# EAGLE design guitar balanced driver x2 (EAGLE 6.4)
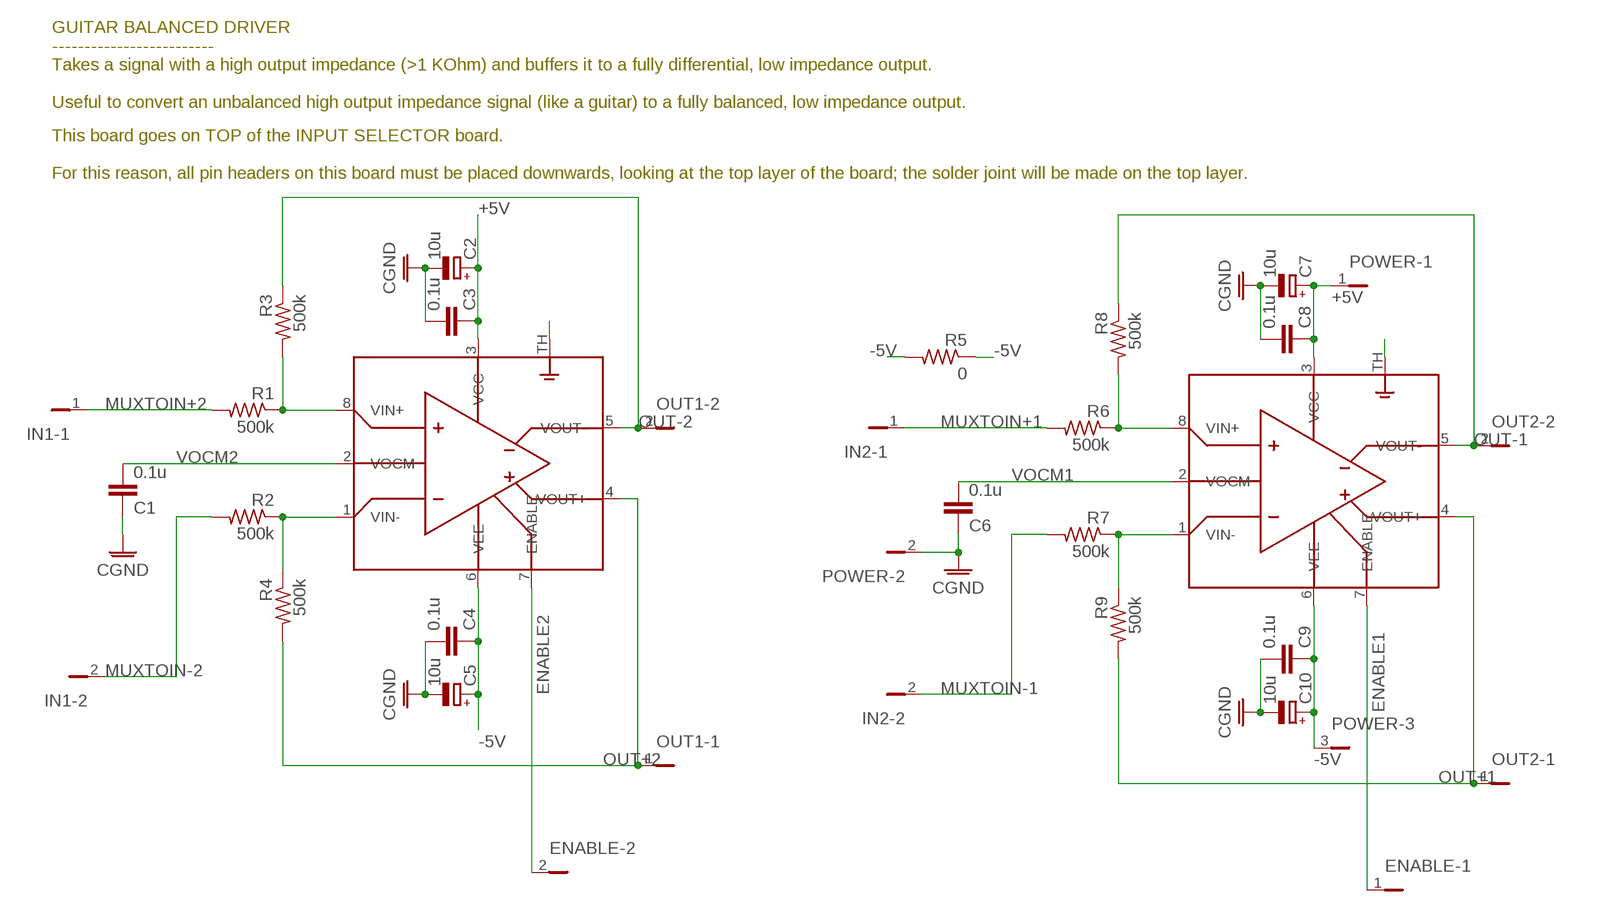
[diagram p0: schematic, sheet 1]

## Parts
C1  0.1u  C-EUC0603  [C0603]
C2  10u  CPOL-EUA  [PANASONIC_A]
C3  0.1u  C-EUC0603  [C0603]
C4  0.1u  C-EUC0603  [C0603]
C5  10u  CPOL-EUA  [PANASONIC_A]
C6  0.1u  C-EUC0603  [C0603]
C7  10u  CPOL-EUA  [PANASONIC_A]
C8  0.1u  C-EUC0603  [C0603]
C9  0.1u  C-EUC0603  [C0603]
C10  10u  CPOL-EUA  [PANASONIC_A]
ENABLE  PINHD-1X2  [1X02]
IN1  PINHD-1X2  [1X02]
IN2  PINHD-1X2  [1X02]
OA1  LME49724  [S-PDSO-G08]
OA2  LME49724  [S-PDSO-G08]
OUT1  PINHD-1X2  [1X02]
OUT2  PINHD-1X2  [1X02]
POWER  PINHD-1X3  [1X03]
R1  500k  R-US_R0603  [R0603]
R2  500k  R-US_R0603  [R0603]
R3  500k  R-US_R0603  [R0603]
R4  500k  R-US_R0603  [R0603]
R5  0  R-US_R0603  [R0603]
R6  500k  R-US_R0603  [R0603]
R7  500k  R-US_R0603  [R0603]
R8  500k  R-US_R0603  [R0603]
R9  500k  R-US_R0603  [R0603]

## Nets
+5V: C2.+ C3.1 C7.+ C8.1 OA1.3(VCC) OA2.3(VCC) POWER.1
-5V: C4.1 C5.+ C9.1 C10.+ OA1.6(VEE) OA1.TH(POWERPAD) OA2.6(VEE) OA2.TH(POWERPAD) POWER.3 R5.1 R5.2
CGND: C1.1 C2.- C3.2 C4.2 C5.- C6.1 C7.- C8.2 C9.2 C10.- POWER.2
ENABLE1: ENABLE.1 OA2.7(ENABLE)
ENABLE2: ENABLE.2 OA1.7(ENABLE)
MUXTOIN+1: IN2.1 R6.2
MUXTOIN+2: IN1.1 R1.2
MUXTOIN-1: IN2.2 R7.2
MUXTOIN-2: IN1.2 R2.2
OUT+1: OA2.4(VOUT+) OUT2.1 R9.2
OUT+2: OA1.4(VOUT+) OUT1.1 R4.2
OUT-1: OA2.5(VOUT-) OUT2.2 R8.1
OUT-2: OA1.5(VOUT-) OUT1.2 R3.1
VIN+1: OA2.8(VIN+) R6.1 R8.2
VIN+2: OA1.8(VIN+) R1.1 R3.2
VIN-1: OA2.1(VIN-) R7.1 R9.1
VIN-2: OA1.1(VIN-) R2.1 R4.1
VOCM1: C6.2 OA2.2(VOCM)
VOCM2: C1.2 OA1.2(VOCM)

## Notes on the sheet
- GUITAR BALANCED DRIVER
  -------------------------
  Takes a signal with a high output impedance (>1 KOhm) and buffers it to a fully differential, low impedance output.
  
  Useful to convert an unbalanced high output impedance signal (like a guitar) to a fully balanced, low impedance output.
- This board goes on TOP of the INPUT SELECTOR board.
  
  For this reason, all pin headers on this board must be placed downwards, looking at the top layer of the board; the solder joint will be made on the top layer.

## Library data of the parts
C1 C3 C4 C6 C8 C9 = rcl:C-EU: CAPACITOR, European symbol
C2 C5 C7 C10 = rcl:CPOL-EU: POLARIZED CAPACITOR, European symbol
ENABLE IN1 IN2 OUT1 OUT2 = pinhead:PINHD-1X2: PIN HEADER
OA1 OA2 = texas:LME49724
POWER = pinhead:PINHD-1X3: PIN HEADER
R1-R9 = resistor:R-US_: RESISTOR, American symbol

## Board
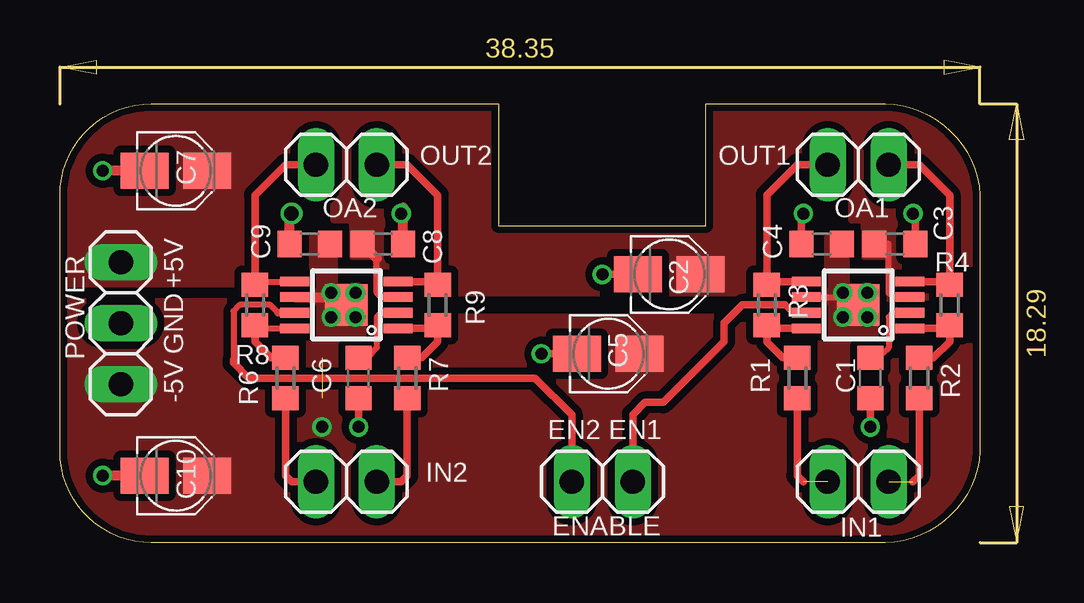
[diagram p1: board, top side]
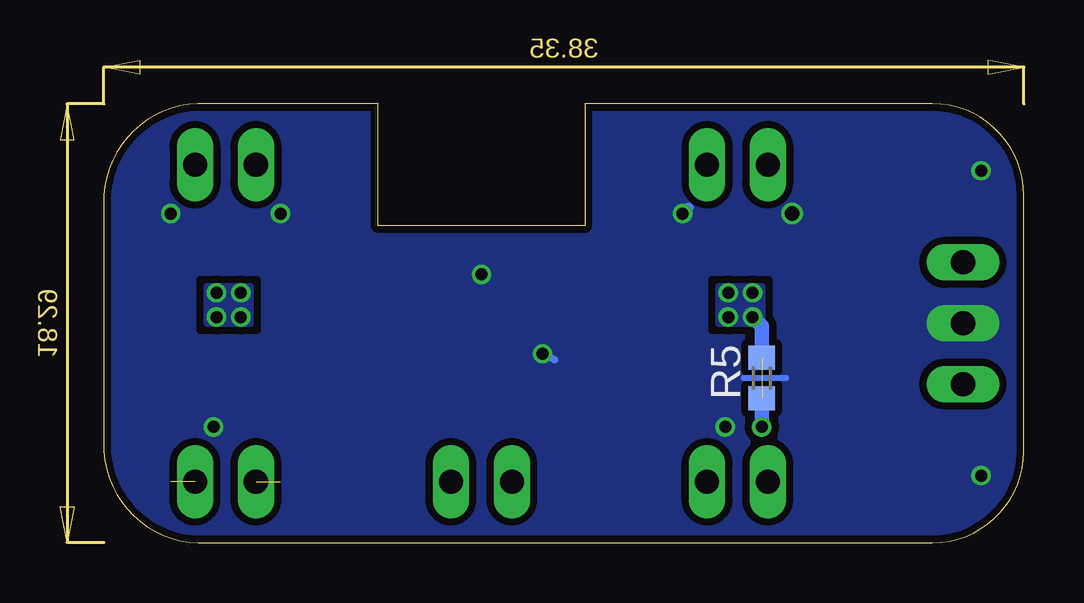
[diagram p2: board, bottom side, seen from below]

Size 38.35 x 18.3 mm. Coordinates in mm from the lower left corner, seen from the top.
Outline: 38.35,14.48 38.35,3.82 arc-90 34.04,0.01 3.81,0.01 arc-90 0,3.82 0,14.48 arc-90 3.81,18.29 18.29,18.29 18.29,13.21 26.92,13.21 26.92,18.29 34.04,18.29 arc-90 38.35,14.48
Copper layers (1*16): Top 0.035mm / dielectric 1.5mm / Bottom 0.035mm
Design rules "Fusion_eagle_rule_v1.1": minimum track width 6mil, minimum drill 12mil, track to track 6mil, track to pad 6mil, pad to pad 6mil, via to via 6mil, smd to smd 0mil, copper to edge 10mil, drill to drill 10mil, minimum pad ring 10mil, minimum via ring 6mil, stop-mask expansion 2mil, vias tented up to drill 100mil, thermal gap 10mil

### Footprints (pad centres in the part's own frame; a part is rotated, then mirrored left to right if it is on the bottom)
C0603 = smd 1 x 1.1: 1 -0.85,0; 2 0.85,0
PANASONIC_A = smd 2 x 1.5: + 1.3,0; - -1.3,0
1X02 = drill 1.016 long: 1 -1.27,0; 2 1.27,0
S-PDSO-G08 = smd 0.4 x 1.2: 1 -0.975,-2.157; 2 -0.325,-2.157; 3 0.325,-2.157; 4 0.975,-2.157; 5 0.975,2.157; 6 0.325,2.157; 7 -0.325,2.157; 8 -0.975,2.157 | smd 1.73 x 1.78: TH 0,0
1X03 = drill 1.016 long: 1 -2.54,0; 2 0,0; 3 2.54,0
R0603 = smd 1 x 1.1: 1 -0.85,0; 2 0.85,0

### Placement (x,y rotation side)
C1  33.78,6.86 90 top
C2  25.4,11.18 0 top
C3  34.8,12.45 0 top
C4  31.75,12.45 180 top
C5  22.86,7.88 0 top
C6  12.45,6.86 90 top
C7  4.83,15.5 0 top
C8  13.46,12.45 0 top
C9  10.41,12.45 180 top
C10  4.83,2.8 0 top
ENABLE  22.61,2.55 0 top
IN1  33.27,2.55 0 top
IN2  11.94,2.55 0 top
OA1  33.27,9.91 90 top
OA2  11.94,9.91 90 top
OUT1  33.27,15.75 180 top
OUT2  11.94,15.75 180 top
POWER  2.54,9.15 270 top
R1  30.73,6.86 270 top
R2  35.81,6.86 270 top
R3  29.46,9.91 270 top
R4  37.08,9.91 90 top
R5  10.92,6.86 90 bottom
R6  9.4,6.86 270 top
R7  14.48,6.86 270 top
R8  8.13,9.91 270 top
R9  15.75,9.91 90 top

### Tracks (layer width: path | path; a pad name or v marks a point on that pad's centre or on a via)
+5V
  Top 0.254: OA2.3 13.39,10.24 13.21,10.42 13.21,11.86 | OA1.3 34.73,10.24 34.54,10.42 34.54,12.45 C3.1
  Top 0.406: 13.21,11.86 C8.1
  pour Top (isolate 0.305, no thermals): 18.29,18.29 4.32,18.29 arc90 0,14.48 0,10.8 7.75,10.8 7.75,12.96 9.4,15.5 11.43,15.5 11.43,13.47 12.19,13.47 12.19,11.94 13.21,11.94 13.21,10.42 14.22,10.42 14.22,15.5 14.48,15.5 15.75,13.47 15.75,10.42 28.7,10.42 28.7,18.29 26.92,18.29 26.92,13.21 18.29,13.21
  pour Top (isolate 0.305, no thermals): 28.7,18.29 28.7,10.42 29.21,10.42 29.21,14.48 30.73,15.75 33.02,15.75 33.02,13.47 33.53,13.47 33.53,11.94 34.54,11.94 34.54,10.17 38.35,10.17 38.35,18.29
-5V  (via drill 0.5)  (1 unrouted)
  Top 0.254: OA1.6 32.46,10.24 v32.64,10.42
  Top 0.406: OA2.6 11.17,10.24 11.26,10.33
  Top 0.61: 11.26,10.33 11.43,10.17
  Bottom 0.61: v10.92,4.83 R5.1 | R5.2 10.92,9.02 v11.3,9.4
  other vias: 11.3,10.42 12.32,10.42 12.32,9.4 33.66,10.42 33.66,9.4 32.64,9.4
  pour Top (isolate 0.305, no thermals): 28.96,0.01 0,0.01 0,10.04 10.54,10.04 10.54,12.71 11.43,12.71 11.43,10.67 12.45,10.67 12.45,9.4 28.96,9.4
  pour Bottom (no thermals): 12.7,10.67 12.7,9.15 10.92,9.15 10.92,10.67
  pour Top (isolate 0.305, no thermals): 34.54,0.01 28.96,0.01 28.96,9.4 29.97,9.4 29.97,10.42 32,10.42 32,12.71 32.77,12.71 32.77,10.67 33.78,10.67 33.78,9.4 38.35,9.4 38.35,4.07 arc-90
  pour Bottom (no thermals): 34.04,10.67 34.04,9.15 32.26,9.15 32.26,10.67
CGND  (via drill 0.5, 0.6)
  Top 0.254: 35.65,13.38 v35.56,13.72
  Top 0.305: C6.1 v12.45,4.83 | C1.1 v33.78,4.83 | C4.2 30.9,13.38 v30.99,13.72 | C3.2 35.65,13.38 | C2.- v22.61,11.18 | C5.- v20.07,7.88
  Top 0.406: C7.- v1.78,15.5 | C10.- v1.78,2.8 | C8.2 14.31,13.98 v14.22,13.72 | C9.2 9.56,13.47 v9.65,13.72
  Bottom 0.254: 9.91,6.86 11.68,6.86 | v35.56,13.72 35.81,13.72
  Bottom 0.305: v33.78,4.83 33.78,4.58 | v22.61,11.18 22.35,11.18 | v20.07,7.88 19.56,7.63
  Bottom 0.406: v14.22,13.72 13.97,13.98
  pour Bottom (isolate 0.305, rank 2, no thermals): 38.35,18.29 38.35,0.01 0,0.01 0,18.29 18.29,18.29 18.29,13.21 26.92,13.21 26.92,18.29
ENABLE1
  Top 0.254: 9.09,9.59 8.76,9.91 7.49,9.91 7.24,9.66 7.24,7.63
  Top 0.305: OA2.7 9.09,9.59 | 7.24,7.63 7.24,7.5 7.87,6.86 19.81,6.86 21.34,5.34 ENABLE.1
ENABLE2
  Top 0.254: OA1.7 30.55,9.59 30.23,9.91
  Top 0.305: 30.23,9.91 28.45,9.91 27.69,9.15 27.69,8.39 25.15,5.85 24.38,5.85 23.88,5.34 ENABLE.2
MUXTOIN+1
  Top 0.305: R6.2 9.4,2.8 9.65,2.55 IN2.1
MUXTOIN+2  (1 unrouted)
  Top 0.305: R1.2 30.73,2.8 30.99,2.55
MUXTOIN-1
  Top 0.305: R7.2 14.48,2.8 14.22,2.55 IN2.2
MUXTOIN-2  (1 unrouted)
  Top 0.305: R2.2 35.81,2.8 35.56,2.55
OUT+1
  Top 0.305: OA2.4 15.75,10.89 R9.2 15.75,14.48 14.48,15.75 OUT2.1
OUT+2
  Top 0.305: OA1.4 36.96,10.89 R4.2 37.08,14.48 35.81,15.75 OUT1.1
OUT-1
  Top 0.254: R8.1 8.13,10.89 OA2.5
  Top 0.305: OUT2.2 9.4,15.75 8.13,14.48 R8.1
OUT-2
  Top 0.305: OA1.5 29.59,10.89 R3.1 29.46,14.48 30.73,15.75 OUT1.2
VIN+1
  Top 0.254: R8.2 8.13,8.94 OA2.8
  Top 0.305: R6.1 8.8,7.71 8.13,8.39 R8.2
VIN+2
  Top 0.305: OA1.8 29.59,8.94 R3.2 29.46,8.39 30.14,7.71 R1.1
VIN-1
  Top 0.305: OA2.1 15.75,8.94 R9.1 15.75,8.39 15.07,7.71 R7.1
VIN-2
  Top 0.305: OA1.1 36.96,8.94 R4.1 37.08,8.39 36.41,7.71 R2.1
VOCM1
  Top 0.254: OA2.2 13.39,9.59 13.21,9.4 13.21,8.13 12.95,7.88
  Top 0.305: 12.95,7.88 12.61,7.88 C6.2
VOCM2
  Top 0.254: OA1.2 34.73,9.59 34.54,9.4 34.54,8.13 34.29,7.88 33.87,7.88
  Top 0.305: 33.87,7.88 C1.2

### Text on the board
tPlace: +5V | GND | -5V | EN2 | EN1